# Altium schematic sheet RELAY2.SchDoc
size A
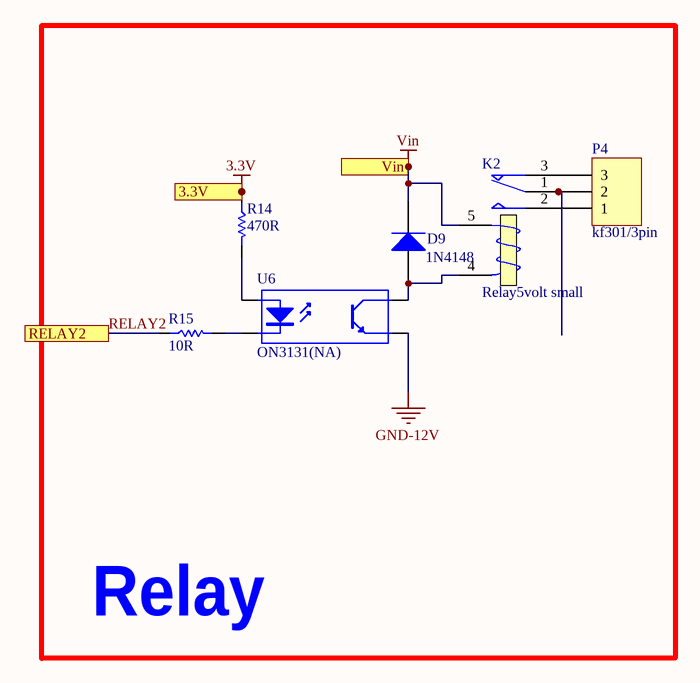
[diagram p0: RELAY2.SchDoc]

## Parts
D9  1N4148  [sod123]
K2  Relay5volt small  [relay5_childern]
P4  kf301/3pin  [Blue Connector 1*3 -kf301]
R14  470R  [0805/resistor]
R15  10R  [0805/resistor]
U6  ON3131(NA)  [OPTO_COUPLER]

## Blocks framed on the sheet
Relay: D9 K2 P4 R14 R15 U6

## Ports
3.3V, RELAY2, Vin

## Nets
3.3V: R14.1 ; port 3.3V
GND-12V: U6.3(E)
Vin: D9.K K2.5 ; port Vin
RELAY2: R15.1 ; port RELAY2
NetD9_A: D9.A K2.4(T2) U6.4(C)
NetK2_1: K2.1(COM) P4.2
NetK2_2: K2.2(NO) P4.1
NetK2_3: K2.3(T1) P4.3
NetR14_2: R14.2 U6.1(A)
NetR15_2: R15.2 U6.2(K)

## Library data of the parts
D9 = Diode 1N4007: 1 Amp General Purpose Rectifier; Published: 8-Jun-2000; LatestRevisionDate: 17-Jul-2002; LatestRevisionNote: Re-released for DXP Platform.; DatasheetVersion: 1998; PackageVersion: Aug-1999; PackageReference: DO-41; Publisher: Altium Limited; PackageDescription: Diode, Axial; Body 5.2 x 2.7 mm (LxDia. max), Lead Dia. 0.86 mm (max); Code_JEDEC: DO-204-AL; ComponentLink1Description: Manufacturer Link; ComponentLink1URL: http://www.fairchildsemi.com/; ComponentLink2Description: Datasheet; ComponentLink2URL: http://www.fairchildsemi.com/ds/1N%2F1N4001.pdf
K2 = Relay: SPDT Relay; Published: 8-Jun-2000; LatestRevisionDate: 17-Jul-2002; LatestRevisionNote: Re-released for DXP Platform.; PackageReference: MODULE5B; Publisher: Altium Limited
P4 = Header 3: LatestRevisionDate: 17-Jul-2002; LatestRevisionNote: Re-released for DXP Platform.; Publisher: Altium Limited
R14 R15 = Resistor: Tolerance: 5%; Power: 1/8 W
  R14: Value: 470R
  R15: Value: 10R
U6 = Optoisolator1: 4-Pin Phototransistor Optocoupler; Published: 24-Mar-1999; LatestRevisionDate: 04-Mar-2005; LatestRevisionNote: Sch pins 3 & 4 Swapped.; DatasheetVersion: Nov-2003; PackageReference: DIP-4; Publisher: Altium Limited